# Altium schematic sheet Sheet4.SchDoc
size A; SheetNumber: 1; SheetTotal: 1
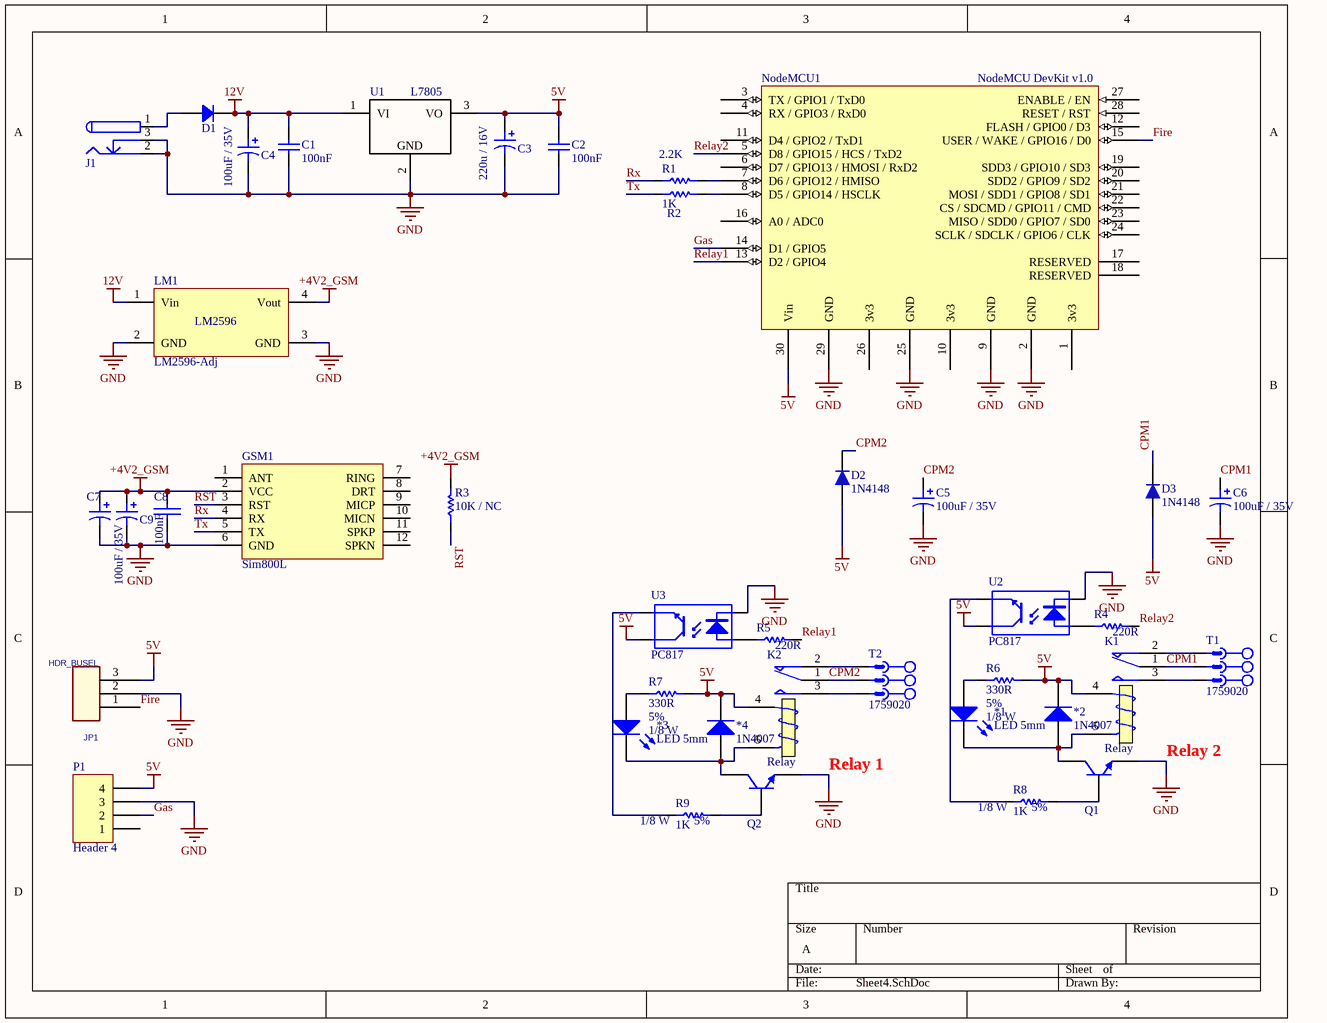
[diagram p0: Sheet4.SchDoc]

## Parts
*1  LED 5mm  [led 5mm]
*2  1N4007  [1N4007]
*3  LED 5mm  [led 5mm]
*4  1N4007  [1N4007]
C1  100nF  [CAPC4817X12N]
C2  100nF  [CAPC4817X12N]
C3  220u / 16V  [Cap electrolitic radial 8x12-3.5]
C4  100uF / 35V  [Cap electrolitic radial 10x20-5]
C5  100uF / 35V  [Cap electrolitic radial 10x20-5]
C6  100uF / 35V  [Cap electrolitic radial 10x20-5]
C7  100uF50V  [Cap electrolitic radial 18x40-7.5]  (value not drawn)
C8  100nF  [Cap - 100nF]
C9  100uF / 35V  [Cap electrolitic radial 10x20-5]
D1  1N4007  [DO41 P7.5MM]  (value not drawn)
D2  1N4148  [DO 35]
D3  1N4148  [DO 35]
GSM1  Sim800L  [Sim800L]
J1  DC Power Jack  [DC Power Jack 1]  (value not drawn)
JP1  HDR_BUSEL  [HDR_1x3]
K1  Relay  [Relay 18.85x15.35x15.70]
K2  Relay  [Relay 18.85x15.35x15.70]
LM1  LM2596-Adj  [lm2596]
NodeMCU1  NodeMCU DevKit v1.0  [NODEMCU]
P1  Header 4  [HDR1X4]
Q1  BC547  [TO-92 BENT]  (value not drawn)
Q2  BC547  [TO-92 BENT]  (value not drawn)
R1  2.2K  [Res-(1/4)]
R2  1K  [Res-(1/4)]
R3  10K / NC  [Res-(1/4)]
R4  220R  [Res-(1/4)]
R5  220R  [Res-(1/4)]
R6  Tolerance: 5%  Power: 1/8 W  [Res-(1/4)]  (hidden comment: 330R)
R7  Tolerance: 5%  Power: 1/8 W  [Res-(1/4)]  (hidden comment: 330R)
R8  Tolerance: 5%  Power: 1/8 W  [Res-(1/4)]  (hidden comment: 1K)
R9  Tolerance: 5%  Power: 1/8 W  [Res-(1/4)]  (hidden comment: 1K)
T1  1759020  [MSTB 2,5/3-G-5,08]
T2  1759020  [MSTB 2,5/3-G-5,08]
U1  L7805  [to220-123-v]
U2  PC817  [DIP4]
U3  PC817  [DIP4]

## Nets
5V: *2.2(K) *4.2(K) C2.1 C3.1 D2.1 D3.1 JP1.3 K1.4(T1) K2.4(T1) NodeMCU1.30(Vin) P1.4 R6.2 R7.2 U1.3(VO) U2.4(C) U3.4(C)
12V: C1.2 C4.1 D1.2 LM1.1(Vin) U1.1(VI)
+4V2_GSM: C7.1 C8.1(+) C9.1 GSM1.2(VCC) LM1.4(Vout) R3.2
GND: C1.1 C2.2 C3.2 C4.2 C5.2 C6.2 C7.2 C8.2(-) C9.2 GSM1.6(GND) J1.2 J1.3 JP1.2 LM1.2(GND) LM1.3(GND) NodeMCU1.2(GND) NodeMCU1.9(GND) NodeMCU1.25(GND) NodeMCU1.29(GND) P1.3 Q1.3(E) Q2.3(E) U1.2 U2.2(K) U3.2(K)
CPM1: C6.1 D3.2 K1.1(COM) T1.2
CPM2: C5.1 D2.2 K2.1(COM) T2.2
Fire: JP1.1 NodeMCU1.15(USER_/_WAKE_/_GPIO16_/_D0)
Gas: NodeMCU1.14(D1_/_GPIO5) P1.2
Relay1: NodeMCU1.13(D2_/_GPIO4) R5.2
Relay2: NodeMCU1.5(D8_/_GPIO15_/_HCS_/_TxD2) R4.2
RST: GSM1.3(RST) R3.1
Rx: GSM1.4(RX) R1.1
Tx: GSM1.5(TX) R2.1
Net*1_1: *1.1(A) R6.1
Net*1_2: *1.2(K) *2.1(A) K1.5(T2) Q1.1(C)
Net*3_1: *3.1(A) R7.1
Net*3_2: *3.2(K) *4.1(A) K2.5(T2) Q2.1(C)
NetD1_1: D1.1 J1.1
NetK1_2: K1.2(NC) T1.3
NetK1_3: K1.3(NO) T1.1
NetK2_2: K2.2(NC) T2.3
NetK2_3: K2.3(NO) T2.1
NetNodeMCU1_7: NodeMCU1.7(D6_/_GPIO12_/_HMISO) R1.2
NetNodeMCU1_8: NodeMCU1.8(D5_/_GPIO14_/_HSCLK) R2.2
NetQ1_2: Q1.2(B) R8.2
NetQ2_2: Q2.2(B) R9.2
NetR4_1: R4.1 U2.1(A)
NetR5_1: R5.1 U3.1(A)
NetR8_1: R8.1 U2.3(E)
NetR9_1: R9.1 U3.3(E)

Not connected (* = marked no-connect by the designer): GSM1 1(ANT) 7(RING) 8(DRT) 9(MICP) 10(MICN) 11(SPKP) 12(SPKN); NodeMCU1 1(3v3) 3(TX_/_GPIO1_/_TxD0) 4(RX_/_GPIO3_/_RxD0) 6(D7_/_GPIO13_/_HMOSI_/_RxD2) 10(3v3) 11(D4_/_GPIO2_/_TxD1) 12(FLASH_/_GPIO0_/_D3) 16(A0_/_ADC0) 17(RESERVED) 18(RESERVED) 19(SDD3_/_GPIO10_/_SD3) 20(SDD2_/_GPIO9_/_SD2) 21(MOSI_/_SDD1_/_GPIO8_/_SD1) 22(CS_/_SDCMD_/_GPIO11_/_CMD) 23(MISO_/_SDD0_/_GPIO7_/_SD0) 24(SCLK_/_SDCLK_/_GPIO6_/_CLK) 26(3v3) 27(ENABLE_/_EN) 28(RESET_/_RST); P1 1

## Notes on the sheet
- (near K2) Relay 1
- (near K1) Relay 2
- (in symbol L7805-TO220) GND
- (in symbol LM2596-Adj) LM2596

## Library data of the parts
C1 C2 = CAP SMD 1206: CAP 1206; Designer: Abbas Basereh; Desc.: CAP SMD 1206; Data: 16-12-2016
C3-C7 C9 = Cap ELECTROLITIC TOTAL SIZE: Cap electrolitic radial; Designer: Abbas Basereh; Data: 16-12-2016; Part. No: *
  C3: VALUE: 220u / 16V
  C4-C6 C9: VALUE: 100uF / 35V
  C7: VALUE: 100uF50V
C8 = Cap-Bipolar: Bipolar Capacitor; Voltage: 100V; Designer: Saeid Jorablo; Organazation: ControTec; Adding Date: 1387/12/20; Value: 100nF
D1 = 1N4007 (THD): Diode Standard 1000V 1A Through Hole DO-204AL (DO-41); PartNumber: 1N4007
D2 D3 = 1N4148: DIODE GEN PURP 100V 200MA DO35; Published: 2017-1-12; PackageVersion: 2017-1-12; PackageReference: DO 35; Publisher: Abbas Basereh; PackageDescription: DIODE GEN PURP 100V 200MA DO35; ComponentLink1Description: Manufacturer Link; ComponentLink1URL: http://www.digikey.com/product-detail/en/fairchild-on-semiconductor/1N4148/1N4148FS-ND/458603; ComponentLink2Description: Datasheet; PART.NO: 1N4148
J1 = DC Power Jack: DC Power Jack. Center Pin 2.5mm. Diameter: 5.7mm; Designer: Ali Hafizi; Company: Personal; Project Name: Laser; Adding Date: 10/21/2009
JP1 = Header 1x3: header or jumper box
K1 K2 = Relay: SPDT Relay; Designer: Eng. Saeid Jorablo; Company: E.P.I.L; Design_Date: 2011/10/31
LM1 = LM2596-Adj: Designed By @Alixahedi
P1 = Header 4: Header, 4-Pin; LatestRevisionDate: 17-Jul-2002; LatestRevisionNote: Re-released for DXP Platform.; Publisher: Altium Limited
Q1 Q2 = BC547: NPN Transistor; Designer: Abbas Basereh; Desc.: Plastic Medium-Power. Silicon NPN Transistors; Data: 27-12-2016
R1-R3 = Resistor: Tolerance: 5%; Power: 1/8 W
  R1: Value: 2.2K
  R2: Value: 1K
  R3: Value: 10K / NC
R4-R9 = Resistor
  R4 R5: Value: 220R
  R6 R7: Value: 330R
  R8 R9: Value: 1K
T1 T2 = CON_Phoenix_MSTB_03: 3 Pitch: 5.08 mm Color: green Contact surface: Tin Assembly; Manufacturer: PHOENIX CONTACT; Connector type: PCB Terminal Block; designer: ABBAS BASEREH; Max Current: 12 A; Positions: 3; Voltage: 320 V; Category: Connector; ComponentLink1Description: Header, Nominal current: 12 A Rated voltage (III/2): 320 V Number of positions: 3 Pitch: 5.08 mm Color: green Contact surface: Tin Assembly: Soldering  DESIGNER:ABBAS BASEREH; ComponentLink2Description: Reference; Mounting Technology: Through-Hole; Pin Count: 3; Revision 1: 2017-3-1; Status: Unreleased; PART.NO: 1759020
U1 = L7805-TO220: LINEAR REGULATOR 5.0V; Supplier 1: Mouser; Supplier Part Number 1: 511-L7805ACP
U2 U3 = OPTCOUPLER_01: 4-Pin Phototransistor Optocoupler